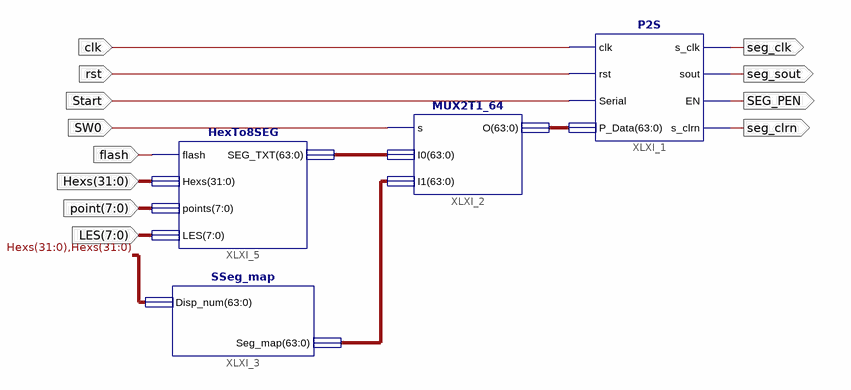
[diagram p0: schematic sheet 1]
// Xilinx ISE schematic Display.sch (kintex7) as structural Verilog: 4 symbols, 12 ports
module Display (
  input  clk,
  input  rst,
  input  Start,
  input  SW0,
  input  flash,
  input  [31:0] Hexs,
  input  [7:0] point,
  input  [7:0] LES,
  output seg_clk,
  output seg_sout,
  output SEG_PEN,
  output seg_clrn
);

  wire [63:0] XLXN_10, XLXN_12, XLXN_14;

  P2S XLXI_1 (
    .clk(clk), .rst(rst), .Serial(Start), .P_Data(XLXN_10), .s_clk(seg_clk), .EN(SEG_PEN), .sout(seg_sout),
    .s_clrn(seg_clrn));
  MUX2T1_64 XLXI_2 (.s(SW0), .I0(XLXN_14), .I1(XLXN_12), .O(XLXN_10));
  SSeg_map XLXI_3 (.Seg_map(XLXN_12), .Disp_num({Hexs, Hexs}));
  HexTo8SEG XLXI_5 (.flash(flash), .Hexs(Hexs), .points(point), .LES(LES), .SEG_TXT(XLXN_14));
endmodule
